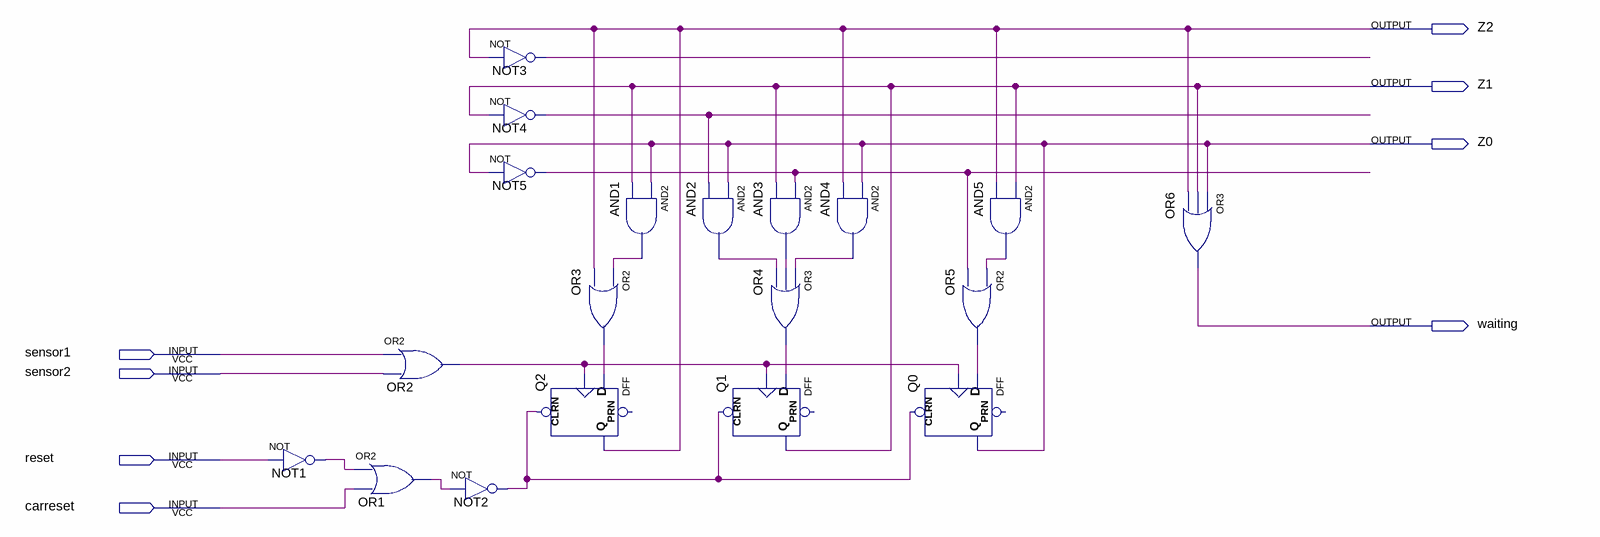
[diagram p0: schematic sheet]
// Quartus schematic CarCounter.bdf as structural Verilog: 19 symbols, 8 pins
module CarCounter (
  input  sensor1,
  input  sensor2,
  input  reset,
  input  carreset,
  output Z2,
  output Z1,
  output Z0,
  output waiting
);

  wire AND1_out, AND2_out, AND3_out, AND4_out, AND5_out, NOT1_out, NOT2_out, NOT3_out, NOT4_out, NOT5_out,
       OR1_out, OR2_out, OR3_out, OR4_out, OR5_out;

  not NOT1 (NOT1_out, reset);
  or OR1 (OR1_out, NOT1_out, carreset);
  or OR2 (OR2_out, sensor1, sensor2);
  not NOT3 (NOT3_out, Z2);
  not NOT4 (NOT4_out, Z1);
  not NOT5 (NOT5_out, Z0);
  not NOT2 (NOT2_out, OR1_out);
  or OR3 (OR3_out, AND1_out, Z2);
  DFF Q2 (.CLRN(NOT2_out), .CLK(OR2_out), .D(OR3_out), .Q(Z2));  // open: PRN
  and AND1 (AND1_out, Z0, Z1);
  and AND2 (AND2_out, Z0, NOT4_out);
  DFF Q1 (.CLRN(NOT2_out), .CLK(OR2_out), .D(OR4_out), .Q(Z1));  // open: PRN
  and AND3 (AND3_out, NOT5_out, Z1);
  or OR4 (OR4_out, AND4_out, AND3_out, AND2_out);
  and AND4 (AND4_out, Z0, Z2);
  or OR5 (OR5_out, AND5_out, NOT5_out);
  DFF Q0 (.CLRN(NOT2_out), .CLK(OR2_out), .D(OR5_out), .Q(Z0));  // open: PRN
  and AND5 (AND5_out, Z1, Z2);
  or OR6 (waiting, Z0, Z1, Z2);
endmodule
